# Altium schematic sheet 11-Wheelspeeds.SchDoc
size A4
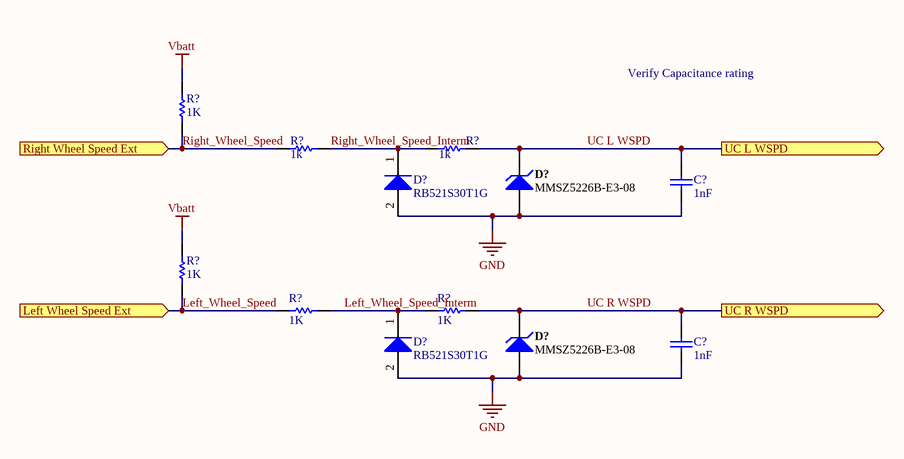
[diagram p0: 11-Wheelspeeds.SchDoc]

## Parts
(Parts that share a designator on the sheet are numbered #1, #2 ... from top to bottom, then left to right.)
C?#1  value 1nF  [1608[0603]]  (hidden comment: Cap)
C?#2  value 1nF  [1608[0603]]  (hidden comment: Cap)
D?#1  RB521S30T1G  [ONSC-SOD-523-2-502-01_V]
D?#2  MMSZ5226B-E3-08  [VISH-SOD-123-2_V]
D?#3  RB521S30T1G  [ONSC-SOD-523-2-502-01_V]
D?#4  MMSZ5226B-E3-08  [VISH-SOD-123-2_V]
R?#1  value 1K  [1608[0603]]  (hidden comment: Res1)
R?#2  value 1k  [1608[0603]]  (hidden comment: Res1)
R?#3  value 1k  [1608[0603]]  (hidden comment: Res1)
R?#4  value 1K  [1608[0603]]  (hidden comment: Res1)
R?#5  value 1K  [1608[0603]]  (hidden comment: Res1)
R?#6  value 1K  [1608[0603]]  (hidden comment: Res1)

## Ports
Left Wheel Speed Ext (in), Right Wheel Speed Ext (in), UC L WSPD (out), UC R WSPD (out)

## Nets
GND: C?#1.1 C?#2.1 D?#1.2(A) D?#2.1(A) D?#3.2(A) D?#4.1(A)
Vbatt: R?#1.2 R?#4.2
Left_Wheel_Speed: R?#4.1 R?#5.2 ; port Left Wheel Speed Ext
Left_Wheel_Speed_Interm: D?#3.1(K) R?#5.1 R?#6.2
Right_Wheel_Speed: R?#1.1 R?#2.1 ; port Right Wheel Speed Ext
Right_Wheel_Speed_Interm: D?#1.1(K) R?#2.2 R?#3.1
UC L WSPD: C?#1.2 D?#2.2(K) R?#3.2 ; port UC L WSPD
UC R WSPD: C?#2.2 D?#4.2(K) R?#6.1 ; port UC R WSPD

## Notes on the sheet
- Verify Capacitance rating

## Library data of the parts
C?#1 C?#2 = Cap: Capacitor; Manufacturer: Yageo; Manufacturer Part Number: CC0603KRX7R9BB102; Capacitance: 1000pF; Tolerance: ±10%; Voltage - Rated: 50V; Temperature Coefficient: X7R; Supplier 1: Digi-Key; Supplier Part Number 1: 311-1080-1-ND; RoHS: RoHS Compliant; Category: Capacitors; Stock 1: 783486; Pricing 1: 1=0.15, 10=0.029, 25=0.0212, 50=0.0158, 100=0.0129, 250=0.01084, 500=0.00928, 1000=0.00729 (CAD); Packaging: Cut Tape (CT); Part Status: Active; Operating Temperature: -55°C ~ 125°C; Features: -; Ratings: -; Applications: General Purpose; Failure Rate: -; Mounting Type: Surface Mount, MLCC; Package / Case: 0603 (1608 Metric); Size / Dimension: 0.063" L x 0.031" W (1.60mm x 0.80mm); Height - Seated (Max): -; Thickness (Max): 0.035" (0.90mm); Lead Spacing: -; Lead Style: -; ComponentLink1URL: http://www.yageo.com/documents/recent/UPY-GPHC_X7R_6.3V-to-50V_16.pdf; ComponentLink1Description: http://www.yageo.com/documents/recent/UPY-GPHC_X7R_6.3V-to-50V_16.pdf
D?#1 D?#3 = CMP-1051-00018-1: Schottky Barrier Diode, 2-Pin SOD-523, Pb-Free, Tape and Reel; Manufacturer: On Semiconductor; Configuration: Single; IFSM Max (A): 1; Mounting Technology: Surface Mount; ComponentLink1Description: Manufacturer URL; PackageReference: SOD-523-2-502-01; RoHS: TRUE; ComponentLink3Description: Package Specification; ComponentLink2Description: Datasheet; PackageVersion: Rev. E, 09/2010; PartNumber: RB521S30T1G; ComponentLink3URL: http://www.onsemi.com/pub_link/Collateral/502-01.PDF; ComponentLink1URL: http://www.onsemi.com/; PackageDescription: 2-Pin SOD, Body 1.2 x 0.8 mm; DatasheetVersion: Rev. 8; ComponentLink2URL: http://www.onsemi.cn/pub_link/Collateral/RB521S30T1-D.PDF; Packing: Tape and Reel
D?#2 D?#4 = CMP-0931-00026-1: Small Signal Zener Diode, 3.3 V +/- 5%, -55 to 155 degC, 2-Pin SOD-123, RoHS, Tape and Reel; Manufacturer: Vishay Semiconductor; Manufacturer Part Number: MMSZ5226B-7-F; Tolerance: +/- 5%; Test Current (IZT1) (mA): 20; Power Dissipation (mW): 500; Int. Construction: Single; Zener Impedance (IZT1) (Max.) (Ohm): 28; Zener Voltage (NOM.) (V): 3.3; Voltage - Zener (Nom) (Vz): 3.3V; Power - Max: 500mW; Impedance (Max) (Zzt): 28 Ohm; Current - Reverse Leakage @ Vr: 25µA @ 1V; Voltage - Forward (Vf) (Max) @ If: 900mV @ 10mA; DatasheetVersion: Rev. 1.9; ComponentLink2Description: Datasheet; PackageReference: SOD-123-2; ComponentLink1URL: http://www.vishay.com/; ComponentLink1Description: Manufacturer URL; Mounting Technology: Surface Mount; ComponentLink3Description: Package Specification; ComponentLink3URL: http://www.vishay.com/docs/85774/mmsz5225.pdf; PartNumber: MMSZ5226B-E3-08; PackageDescription: 2-Pin SMD, Body 2.7 x 1.55 mm, Height 1.35 mm; Operating Temperature: -55 to 150 degC; Packing: Tape and Reel; PackageVersion: Rev. 1.9; ComponentLink2URL: http://www.vishay.com/docs/85774/mmsz5225.pdf; RoHS: TRUE; Supplier 1: Digi-Key; Supplier Part Number 1: MMSZ5226B-FDICT-ND; Category: Discrete Semiconductor Products; Stock 1: 45935; Pricing 1: 1=0.29, 10=0.263, 100=0.1426, 500=0.08778, 1000=0.05985 (CAD); Packaging: Cut Tape (CT); Part Status: Active; Mounting Type: Surface Mount; Package / Case: SOD-123; Supplier Device Package: SOD-123; ComponentLink4URL: http://www.diodes.com/_files/datasheets/ds18010.pdf; ComponentLink4Description: http://www.diodes.com/_files/datasheets/ds18010.pdf
R?#1 R?#4-R?#6 = Res1: Resistor; Manufacturer: Panasonic Electronic Components; Manufacturer Part Number: ERJ-PA3F1001V; Tolerance: ±1%; Power (Watts): 0.25W, 1/4W; Temperature Coefficient: ±100ppm/°C; Supplier 1: Digi-Key; Supplier Part Number 1: P1.0KBYCT-ND; RoHS: RoHS Compliant; Category: Resistors; Stock 1: 56110; Pricing 1: 1=0.22, 10=0.198, 25=0.138, 50=0.1072, 100=0.0765, 250=0.05972, 500=0.04746, 1000=0.03368 (CAD); Packaging: Cut Tape (CT); Part Status: Active; Resistance (Ohms): 1k; Composition: Thick Film; Features: Automotive AEC-Q200, Pulse Withstanding; Operating Temperature: -55°C ~ 155°C; Package / Case: 0603 (1608 Metric); Supplier Device Package: 0603; Size / Dimension: 0.063" L x 0.031" W (1.60mm x 0.80mm); Height - Seated (Max): 0.022" (0.55mm); Number of Terminations: 2; Failure Rate: -; ComponentLink1URL: https://industrial.panasonic.com/cdbs/www-data/pdf/RDA0000/AOA0000C243.pdf; ComponentLink1Description: https://industrial.panasonic.com/cdbs/www-data/pdf/RDA0000/AOA0000C243.pdf
R?#2 R?#3 = Res1: Resistor; Manufacturer: Yageo; Manufacturer Part Number: RC0603JR-075K1L; Resistance (Ohms): 5.1k; Tolerance: ±5%; Power (Watts): 0.1W, 1/10W; Temperature Coefficient: ±100ppm/°C; Supplier 1: Digi-Key; Supplier Part Number 1: 311-5.1KGRCT-ND; RoHS: RoHS Compliant; Category: Resistors; Stock 1: 782184; Pricing 1: 1=0.16, 10=0.016, 25=0.0112, 50=0.0084, 100=0.0062, 250=0.0048, 500=0.00382, 1000=0.00281 (CAD); Packaging: Cut Tape (CT); Part Status: Active; Composition: Thick Film; Features: Moisture Resistant; Operating Temperature: -55°C ~ 155°C; Package / Case: 0603 (1608 Metric); Supplier Device Package: 0603; Size / Dimension: 0.063" L x 0.031" W (1.60mm x 0.80mm); Height - Seated (Max): 0.022" (0.55mm); Number of Terminations: 2; Failure Rate: -; ComponentLink1URL: http://www.yageo.com/NewPortal/yageodocoutput?fileName=/pdf/R-Chip/PYu-RC_Group_51_RoHS_L_4.pdf; ComponentLink1Description: http://www.yageo.com/NewPortal/yageodocoutput?fileName=/pdf/R-Chip/PYu-RC_Group_51_RoHS_L_4.pdf